# EAGLE schematic 20W-IR-Blaster (EAGLE 9.6.2)
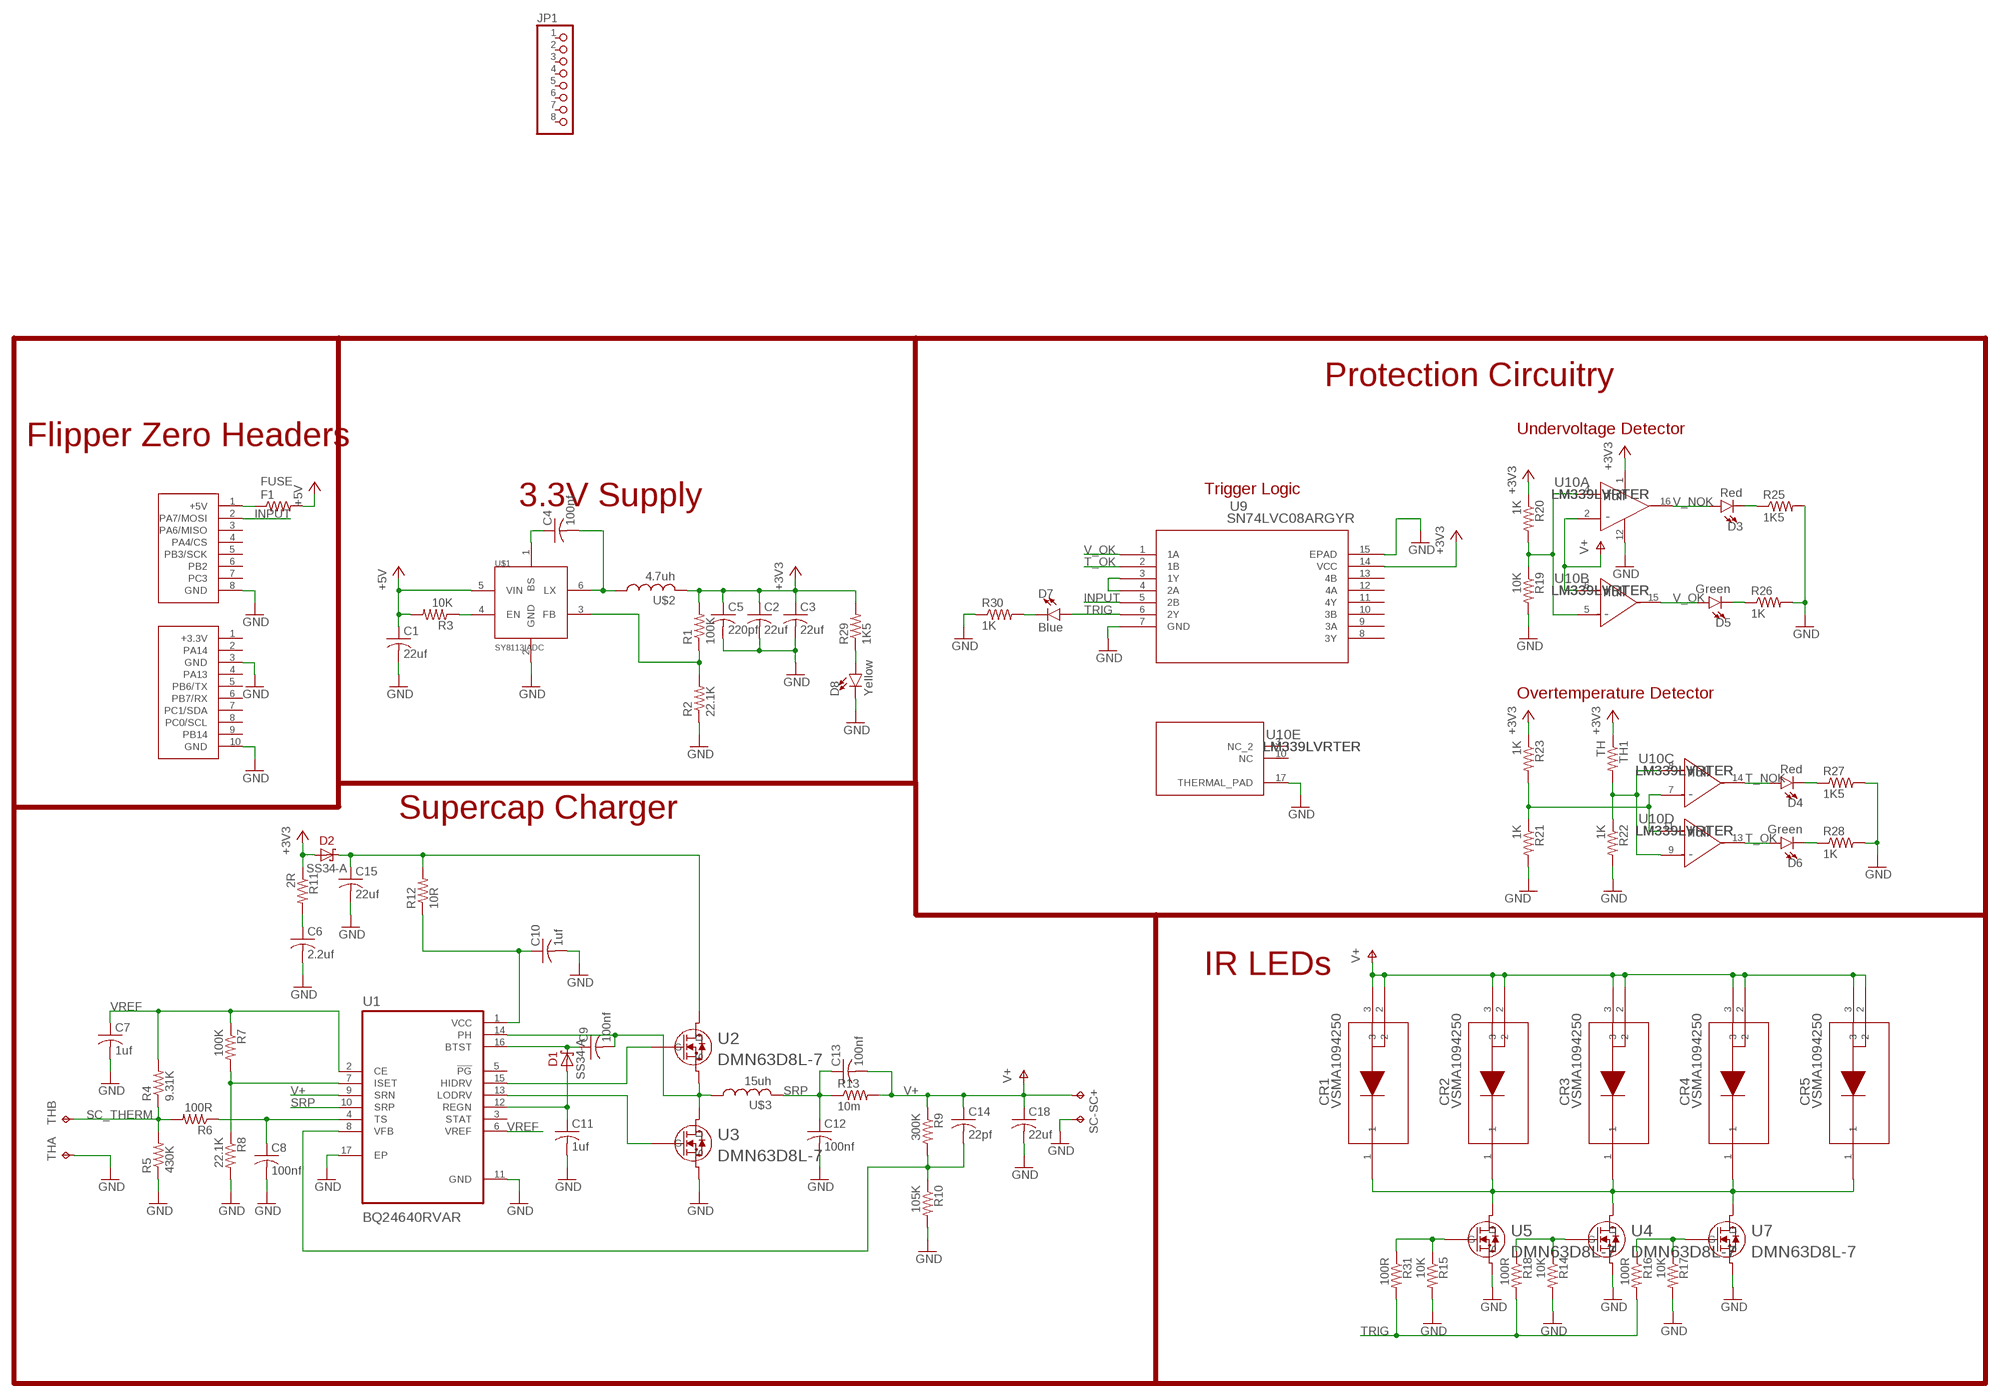
[diagram p0: schematic, sheet 1]

## Parts
C1  22uf  C-USC3216  [C3216]
C2  22uf  C-USC3216  [C3216]
C3  22uf  C-USC3216  [C3216]
C4  100nf  C-USC0603  [C0603]
C5  220pf  C-USC0603  [C0603]
C6  2.2uf  C-USC0603  [C0603]
C7  1uf  C-USC0603  [C0603]
C8  100nf  C-USC0603  [C0603]
C9  100nf  C-USC0603  [C0603]
C10  1uf  C-USC0603  [C0603]
C11  1uf  C-USC0603  [C0603]
C12  100nf  C-USC0603  [C0603]
C13  100nf  C-USC0603  [C0603]
C14  22pf  C-USC0603  [C0603]
C15  22uf  C-USC3216  [C3216]
C18  22uf  C-USC3216  [C3216]
CR1  VSMA1094250  [DIODE_VSMA1094250_VIS]
CR2  VSMA1094250  [DIODE_VSMA1094250_VIS]
CR3  VSMA1094250  [DIODE_VSMA1094250_VIS]
CR4  VSMA1094250  [DIODE_VSMA1094250_VIS]
CR5  VSMA1094250  [DIODE_VSMA1094250_VIS]
D1  SS34-A  [DO-214AC]
D2  SS34-A  [DO-214AC]
D3  Red  LED-RED0603  [LED-0603]
D4  Red  LED-RED0603  [LED-0603]
D5  Green  LED-GREEN0603  [LED-0603]
D6  Green  LED-GREEN0603  [LED-0603]
D7  Blue  LED-BLUE0603  [LED-0603]
D8  Yellow  LED-YELLOW0603  [LED-0603]
F1  FUSE  R-US_R1206  [R1206]
JP1  PINHD-1X8  [1X08]
R1  100K  R-US_R0603  [R0603]
R2  22.1K  R-US_R0603  [R0603]
R3  10K  R-US_R0603  [R0603]
R4  9.31K  R-US_R0603  [R0603]
R5  430K  R-US_R0603  [R0603]
R6  100R  R-US_R0603  [R0603]
R7  100K  R-US_R0603  [R0603]
R8  22.1K  R-US_R0603  [R0603]
R9  300K  R-US_R0603  [R0603]
R10  105K  R-US_R0603  [R0603]
R11  2R  R-US_R2512  [R2512]
R12  10R  R-US_R2512  [R2512]
R13  10m  R-US_R0805  [R0805]
R14  10K  R-US_R0603  [R0603]
R15  10K  R-US_R0603  [R0603]
R16  100R  R-US_R0603  [R0603]
R17  10K  R-US_R0603  [R0603]
R18  100R  R-US_R0603  [R0603]
R19  10K  R-US_R0603  [R0603]
R20  1K  R-US_R0603  [R0603]
R21  1K  R-US_R0603  [R0603]
R22  1K  R-US_R0603  [R0603]
R23  1K  R-US_R0603  [R0603]
R25  1K5  R-US_R0603  [R0603]
R26  1K  R-US_R0603  [R0603]
R27  1K5  R-US_R0603  [R0603]
R28  1K  R-US_R0603  [R0603]
R29  1K5  R-US_R0603  [R0603]
R30  1K  R-US_R0603  [R0603]
R31  100R  R-US_R0603  [R0603]
SC+  TPPAD1-20Y  [P1-20Y]
SC-  TPPAD1-20Y  [P1-20Y]
TH  TP2P2-38-17  [P2-38-17]
TH1  TH  R-US_R0603  [R0603]
U1  BQ24640RVAR  [QFN50P350X350X100-17N]
U2  DMN63D8L-7  [SOIC_63D8L-7_DIO]
U3  DMN63D8L-7  [SOIC_63D8L-7_DIO]
U4  DMN63D8L-7  [SOIC_63D8L-7_DIO]
U5  DMN63D8L-7  [SOIC_63D8L-7_DIO]
U7  DMN63D8L-7  [SOIC_63D8L-7_DIO]
U9  SN74LVC08ARGYR  [RGY14_2P05X2P05]
U10  LM339LVRTER  [RTE0016C-IPC_A]
U$1  SY8113IADC  [TSOT6]
U$2  4.7uh  CYH127-4.7UH  [CYH127-4.7UH]
U$3  15uh  CYH127-4.7UH  [CYH127-4.7UH]
U$4  LEFT-H1-SMD  [LEFT-H1-SMD]
U$5  RIGHT-H2-SMD  [RIGHT-H2-SMD]

## Nets
+3V3: C2.1 C3.1 C5.1 D2.A R1.2 R11.1 R20.1 R23.1 R29.2 TH1.1 U9.14(VCC) U10.1(A:V+) U$2.P$2
+5V: C1.1 F1.2 R3.2 U$1.5(VIN)
GND: C1.2 C2.2 C3.2 C5.2 C6.2 C7.2 C8.2 C10.2 C11.2 C12.2 C15.2 C18.2 D8.C R2.1 R5.1 R8.2 R10.2 R14.2 R15.2 R17.2 R19.2 R21.2 R22.2 R25.2 R26.2 R27.2 R28.2 R30.1 SC-.TP TH.TP-1 U1.11(GND) U1.17(EP) U3.3(S) U4.3(S) U5.3(S) U7.3(S) U9.7(GND) U9.15(EPAD) U10.12(A:GND) U10.17(E:THERMAL_PAD) U$1.2(GND) U$4.8(GND) U$5.3(GND) U$5.10(GND)
INPUT: U9.5(2B) U$4.2(PA7/MOSI)
N$1: R3.1 U$1.4(EN)
N$2: C4.1 U$1.1(BS)
N$3: C4.2 U$1.6(LX) U$2.P$1
N$4: C9.2 U1.14(PH) U2.3(S) U3.2(D) U$3.P$1
N$5: R1.1 R2.2 U$1.3(FB)
N$6: C6.1 R11.2
N$7: C15.1 D2.C R12.2 U2.2(D)
N$8: C10.1 R12.1 U1.1(VCC)
N$9: U1.15(HIDRV) U2.1(G)
N$10: U1.13(LODRV) U3.1(G)
N$11: C9.1 D1.C U1.16(BTST)
N$12: C11.1 D1.A U1.12(REGN)
N$13: CR1.1 CR2.1 CR3.1 CR4.1 CR5.1 U4.2(D) U5.2(D) U7.2(D)
N$14: R19.1 R20.2 U10.4(A:IN1+) U10.5(B:IN2-)
N$15: R15.1 R31.1 U5.1(G)
N$16: C14.2 R9.2 R10.1 U1.8(VFB)
N$17: C8.1 R6.1 U1.4(TS)
N$18: F1.1 U$4.1(+5V)
N$19: R14.1 R18.1 U4.1(G)
N$20: R21.1 R23.2 U10.7(C:IN3-) U10.11(D:IN4+)
N$21: R16.1 R17.1 U7.1(G)
N$24: U9.3(1Y) U9.4(2A)
N$25: R7.2 R8.1 U1.7(ISET)
N$26: R22.1 TH1.2 U10.8(C:IN3+) U10.9(D:IN4-)
N$27: D3.C R25.1
N$28: D5.C R26.1
N$29: D4.C R27.1
N$30: D6.C R28.1
N$31: D8.A R29.1
N$32: D7.C R30.2
SC_THERM: R4.1 R5.2 R6.2 TH.TP-2
SRP: C12.1 C13.1 R13.1 U1.10(SRP) U$3.P$2
T_NOK: D4.A U10.14(C:OUT3)
T_OK: D6.A U9.2(1B) U10.13(D:OUT4)
TRIG: D7.A R16.2 R18.2 R31.2 U9.6(2Y)
V+: C13.2 C14.1 C18.1 CR1.2 CR1.3 CR2.2 CR2.3 CR3.2 CR3.3 CR4.2 CR4.3 CR5.2 CR5.3 R9.1 R13.2 SC+.TP U1.9(SRN) U10.2(A:IN1-) U10.6(B:IN2+)
V_NOK: D3.A U10.16(A:OUT1)
V_OK: D5.A U9.1(1A) U10.15(B:OUT2)
VREF: C7.1 R4.2 R7.1 U1.2(CE) U1.6(VREF)
Unconnected: JP1.1 JP1.2 JP1.3 JP1.4 JP1.5 JP1.6 JP1.7 JP1.8 U1.3(STAT) U1.5(!PG) U9.8(3Y) U9.9(3A) U9.10(3B) U9.11(4Y) U9.12(4A) U9.13(4B) U10.3(E:NC_2) U10.10(E:NC) U$4.3(PA6/MISO) U$4.4(PA4/CS) U$4.5(PB3/SCK) U$4.6(PB2) U$4.7(PC3) U$5.1(+3.3V) U$5.2(PA14) U$5.4(PA13) U$5.5(PB6/TX) U$5.6(PB7/RX) U$5.7(PC1/SDA) U$5.8(PC0/SCL) U$5.9(PB14)

## Notes on the sheet
- Protection Circuitry
- Undervoltage Detector
- Flipper Zero Headers
- Trigger Logic
- 3.3V Supply
- Overtemperature Detector
- Supercap Charger
- IR LEDs

## Library data of the parts
C1-C15 C18 = rcl:C-US: CAPACITOR, American symbol; SPICEPREFIX: C
CR1-CR5 = VSMA1094250:VSMA1094250; COPYRIGHT: Copyright (C) 2025 Ultra Librarian. All rights reserved.; MANUFACTURER_PART_NUMBER: VSMA1094250; MFR_NAME: Vishay
D1 D2 = SS34-A:SS34-A: Check availability <https://pricing.snapeda.com/parts/SS34A/TE%20Connectivity/view-part?ref=eda>; AVAILABILITY: In Stock; CHECK_PRICES: https://www.snapeda.com/parts/SS34A/TE+Connectivity+AMP+Connectors/view-part/?ref=eda; DESCRIPTION: 34 Position Cable Assembly Rectangular Socket to Cable 3.00' (914.40mm); MF: TE Connectivity; MP: SS34A; PACKAGE: DO-214 Multicomp; PRICE: None; SNAPEDA_LINK: https://www.snapeda.com/parts/SS34A/TE+Connectivity+AMP+Connectors/view-part/?ref=snap
D3 D4 = SparkFun-LED:LED-RED: Red SMD LED Used in manufacturing of most products at SparkFun Packages: 0603 - KB - KingBright (DIO-17976) SMD 0603 package [Datasheet] <https://www.kingbrightusa.com/images/catalog/SPEC/APT1608SURCK.pdf> 0603 - (DIO-00819, has gone EOL) SMD 0603 package 0603 SMART - SMD 0603 SMART package ( more efficient and expensive)[Product Link] <http://www.osram-os.com/Graphics/XPic2/00077099_0.pdf> 1206 - SMD1206 package [Product Link] <https://www.sparkfun.com/datasheets/DevTools/LilyPad/Q150OVS4.pdff> SparkFun Products: Pro Mini 328 -5V <https://www.sparkfun.com/products/821> RedBoard <https://www.sparkfun.com/products/12757> IOIO-OTG <https://www.sparkfun.com/products/13613>; PROD_ID: DIO-00819
D5 D6 = SparkFun-LED:LED-GREEN: Green SMD LED Used in manufacturing of various products at SparkFun Packages: 0603 - SMD 0603 package [Product Link] <http://www.futureelectronics.com/en/technologies/semiconductors/optoelectronics/leds/Pages/9894312-LTST-C190GKT.aspx?CrossPart=HSMG-C190&IM=0> LilyPad 1206 - SMD1206 LilyPad package [Product Link] <http://www.futureelectronics.com/en/Technologies/Product.aspx?ProductID=IN150NGHARVATEKCORPORATION2049943&IM=0> 1206 - SMD1206 package [Product Link] <http://www.futureelectronics.com/en/technologies/semiconductors/optoelectronics/leds/Pages/8315665-LTST-C150KGKT.aspx?IM=0> 1206 Bottom Mount -SMD 1206 Bottom Mount [Product Link] <http://www.digikey.com/product-detail/en/lite-on-inc/LTST-C230KGKT/160-1456-1-ND/386854> SparkFun Products: Pro Mini 328 -5V <https://www.sparkfun.com/products/821> RedBoard <https://www.sparkfun.com/products/12757> MP3 Trigger <https://www.sparkfun.com/products/13720> Makey Makey <https://www.sparkfun.com/products/11076>; PROD_ID: DIO-00821
D7 = SparkFun-LED:LED-BLUE: Blue SMD LED Used in manufacturing of various products at SparkFun Packages: 0603 - SMD 0603 package [Product Link] <http://www.digikey.com/product-detail/en/SMLE12BC7TT86/511-1589-2-ND/1641808> 1206 - SMD1206 package [Product Link] <http://www.digikey.com/product-detail/en/lite-on-inc/LTST-C150TBKT/160-1643-1-ND/573584> SparkFun Products: ESP8266 Thing-Dev Board <https://www.sparkfun.com/products/13711> RedBoard <https://www.sparkfun.com/products/12757>; PROD_ID: DIO-08575
D8 = SparkFun-LED:LED-YELLOW: Yellow SMD LED Used in manufacturing several products at SparkFun. Packages: 0603 - SMD 0603 package[Product Link] <http://www.kingbrightusa.com/product.asp?catalog_name=LED&product_id=APT1608SYCK> 0603 -SMART - SMART SMD 0603 package (more efficient/more expensive) [Product Link] <http://www.osram-os.com/osram_os/en/products/product-catalog/led-light-emitting-diodes/smartled-0603/ly-l29k/index.jsp> LilyPad - SMD1206 package[Product Datasheet] <https://www.sparkfun.com/datasheets/DevTools/LilyPad/Q150YUS4.pdf> SparkFun Products: Blynk Board <https://www.sparkfun.com/products/13794> IOIO-OTG <https://www.sparkfun.com/products/13613> XBee Explorer Serial <https://www.sparkfun.com/products/13225>; PROD_ID: DIO-09003
F1 R1-R23 R25-R31 TH1 = rcl:R-US_: RESISTOR, American symbol; SPICEPREFIX: R
JP1 = pinhead:PINHD-1X8: PIN HEADER
SC+ SC- = testpad:TP: Test pad
TH = testpad:TP2: Test pad
U1 = BQ24640RVAR:BQ24640RVAR
U2-U5 U7 = AO3400:DMN63D8L-7; COPYRIGHT: Copyright (C) 2025 Ultra Librarian. All rights reserved.; MANUFACTURER_PART_NUMBER: DMN63D8L-7; MFR_NAME: Diodes Inc
U9 = SN74LVC08ARGYR:SN74LVC08ARGYR; COPYRIGHT: Copyright (C) 2025 Ultra Librarian. All rights reserved.; MANUFACTURER_PART_NUMBER: SN74LVC08ARGYR; MFR_NAME: Texas Instruments
U10 = LM339LVRTER:LM339LVRTER; COPYRIGHT: Copyright (C) 2025 Ultra Librarian. All rights reserved.; MANUFACTURER_PART_NUMBER: LM339LVRTER; MFR_NAME: Texas Instruments; REFDES: RefDes; TYPE: TYPE
U$1 = SY8113IADC:SY8113IADC
U$2 U$3 = CYH127-4.7UH:CYH127-4.7UH
U$4 = Flipper-Zero-GPIO-Headers:LEFT-H1-SMD
U$5 = Flipper-Zero-GPIO-Headers:RIGHT-H2-SMD